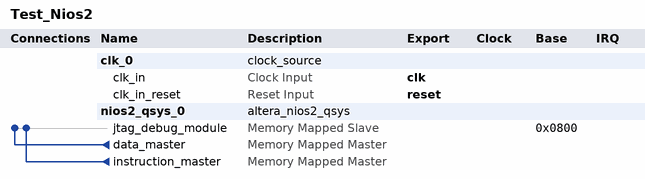
[diagram p0: system contents]
# Platform Designer (Qsys) system Test_Nios2, MAX 10 10M08SAE144C8GES
# Parameters at their usual value, and those the tool derives, are not listed.
package require -exact qsys 14.1
create_system Test_Nios2
set_project_property DEVICE_FAMILY {MAX 10}
set_project_property DEVICE 10M08SAE144C8GES

add_instance clk_0 clock_source 14.1
set_instance_parameter_value clk_0 clockFrequency 50000000

add_instance nios2_qsys_0 altera_nios2_qsys 14.1
set_instance_parameter_value nios2_qsys_0 breakSlave nios2_qsys_0.jtag_debug_module
set_instance_parameter_value nios2_qsys_0 exceptionSlave None
set_instance_parameter_value nios2_qsys_0 icache_size 4096
set_instance_parameter_value nios2_qsys_0 impl Small
set_instance_parameter_value nios2_qsys_0 mmu_TLBMissExcSlave None
set_instance_parameter_value nios2_qsys_0 muldiv_multiplierType DSPBlock
set_instance_parameter_value nios2_qsys_0 resetSlave None
set_instance_parameter_value nios2_qsys_0 resetrequest_enabled true

# connections
add_connection nios2_qsys_0.data_master nios2_qsys_0.jtag_debug_module avalon
set_connection_parameter_value nios2_qsys_0.data_master/nios2_qsys_0.jtag_debug_module baseAddress 0x0800
add_connection nios2_qsys_0.instruction_master nios2_qsys_0.jtag_debug_module avalon
set_connection_parameter_value nios2_qsys_0.instruction_master/nios2_qsys_0.jtag_debug_module baseAddress 0x0800

# exported interfaces
add_interface clk clock sink
set_interface_property clk EXPORT_OF clk_0.clk_in
add_interface reset reset sink
set_interface_property reset EXPORT_OF clk_0.clk_in_reset

set_interconnect_requirement {$system} qsys_mm.clockCrossingAdapter HANDSHAKE
set_interconnect_requirement {$system} qsys_mm.insertDefaultSlave FALSE
set_interconnect_requirement {$system} qsys_mm.maxAdditionalLatency 1

save_system Test_Nios2.qsys
